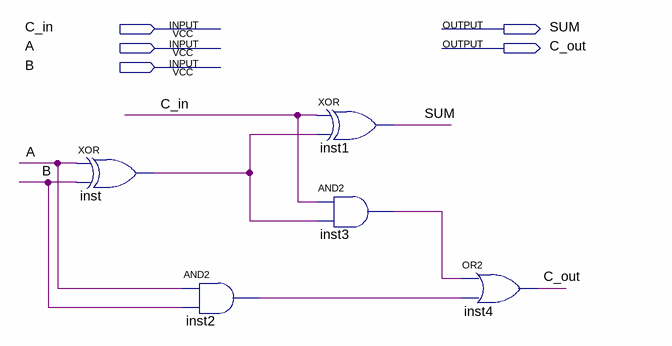
[diagram p0: schematic sheet]
// Quartus schematic g39_fulladder2.bdf as structural Verilog: 5 symbols, 5 pins
module g39_fulladder2 (
  input  C_in,
  input  A,
  input  B,
  output SUM,
  output C_out
);

  wire inst2_out, inst3_out, inst_out;

  xor inst (inst_out, A, B);
  and inst2 (inst2_out, A, B);
  xor inst1 (SUM, C_in, inst_out);
  and inst3 (inst3_out, C_in, inst_out);
  or inst4 (C_out, inst3_out, inst2_out);
endmodule
